# Altium schematic sheet 11-DFlipFlop.SchDoc
size A4; DocumentNumber: 11; SheetNumber: 11; SheetTotal: 26
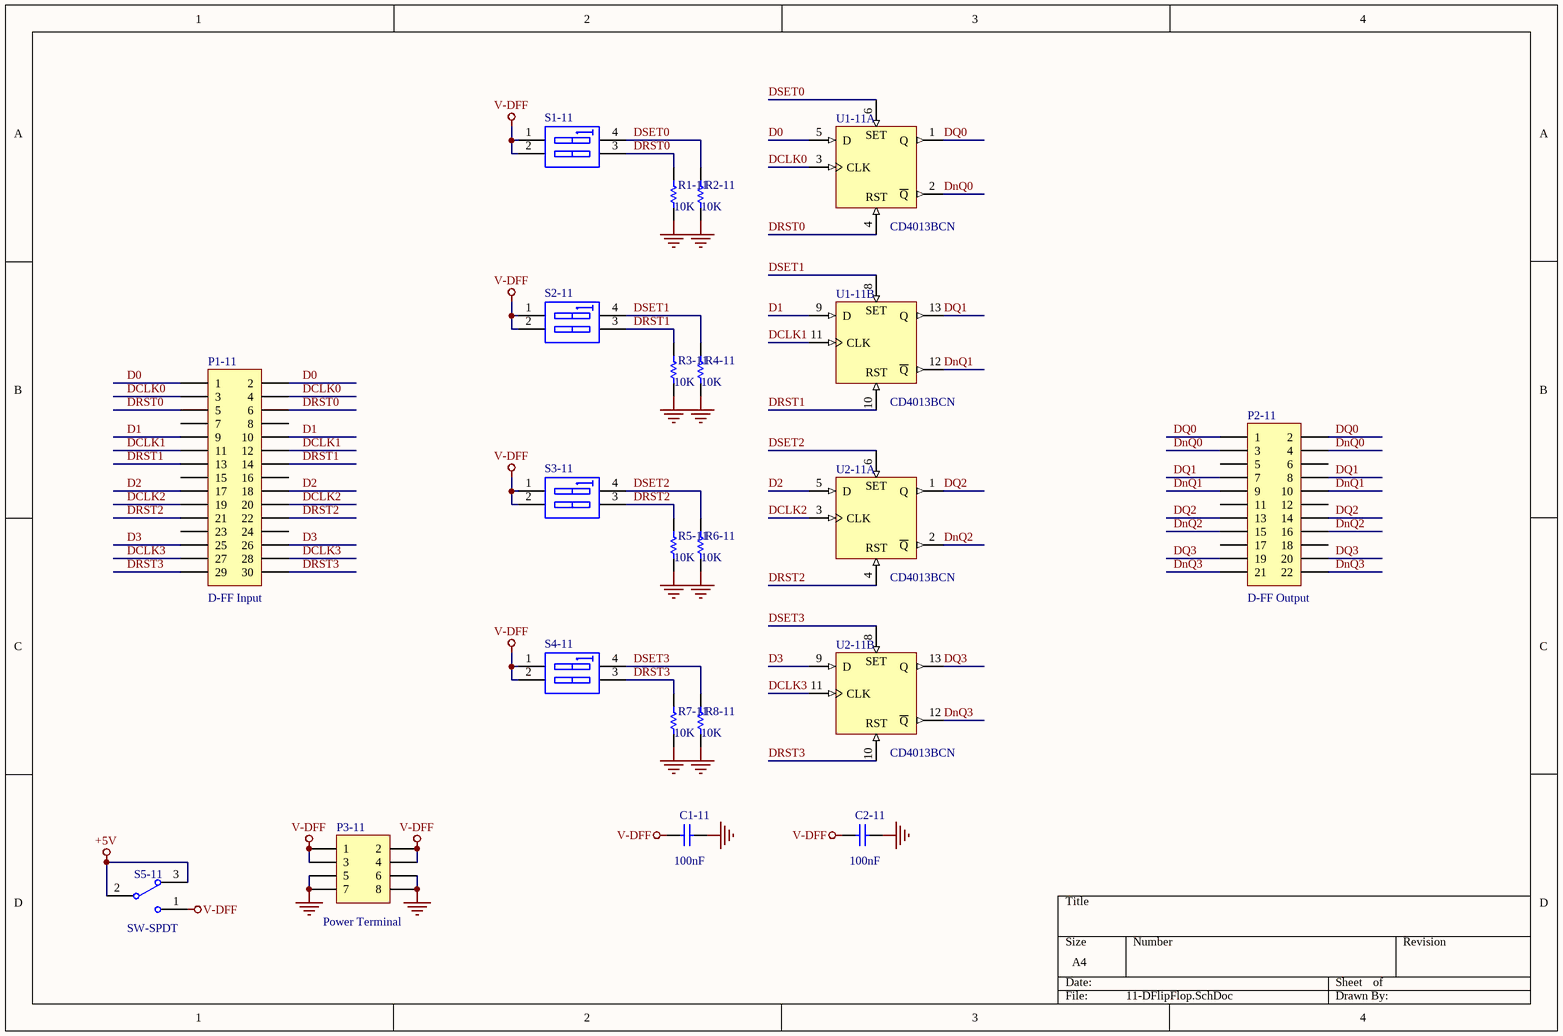
[diagram p0: 11-DFlipFlop.SchDoc]

## Parts
C1-11  value 100nF  [c-0805]  (hidden comment: 104)
C2-11  value 100nF  [c-0805]  (hidden comment: 104)
P1-11  value D-FF Input  [JP2.54-F-2x15A]  (hidden comment: Header 15X2)
P2-11  value D-FF Output  [JP2.54-F-2x11A]  (hidden comment: Header 11X2)
P3-11  Publisher: Power Terminal  [JP2.54-F-2x04A]  (hidden comment: Header 4X2)
R1-11  10K  [R-0805]
R2-11  10K  [R-0805]
R3-11  10K  [R-0805]
R4-11  10K  [R-0805]
R5-11  10K  [R-0805]
R6-11  10K  [R-0805]
R7-11  10K  [R-0805]
R8-11  10K  [R-0805]
S1-11  SW DIP-2  [SW-DIP2-SMD]  (value not drawn)
S2-11  SW DIP-2  [SW-DIP2-SMD]  (value not drawn)
S3-11  SW DIP-2  [SW-DIP2-SMD]  (value not drawn)
S4-11  SW DIP-2  [SW-DIP2-SMD]  (value not drawn)
S5-11  SW-SPDT  [SW-SLIDE-2P-2W]
U1-11  CD4013BCN  [SK-DIP14-300]  (parts A,B of 2)
U2-11  CD4013BCN  [SK-DIP14-300]  (parts A,B of 2)

## Nets
+5V: S5-11.2 S5-11.3
GND: C1-11.2 C2-11.2 P3-11.5 P3-11.6 P3-11.7 P3-11.8 R1-11.1 R2-11.1 R3-11.1 R4-11.1 R5-11.1 R6-11.1 R7-11.1 R8-11.1 U1-11.7(GND) U2-11.7(GND)
V-DFF: C1-11.1 C2-11.1 P3-11.1 P3-11.2 P3-11.3 P3-11.4 S1-11.1(A1) S1-11.2(A2) S2-11.1(A1) S2-11.2(A2) S3-11.1(A1) S3-11.2(A2) S4-11.1(A1) S4-11.2(A2) S5-11.1
VDD: U1-11.14(V-DFF) U2-11.14(V-DFF)
D0: P1-11.1 P1-11.2 U1-11.5(D)
D1: P1-11.9 P1-11.10 U1-11.9(D)
D2: P1-11.17 P1-11.18 U2-11.5(D)
D3: P1-11.25 P1-11.26 U2-11.9(D)
DCLK0: P1-11.3 P1-11.4 U1-11.3(CLK)
DCLK1: P1-11.11 P1-11.12 U1-11.11(CLK)
DCLK2: P1-11.19 P1-11.20 U2-11.3(CLK)
DCLK3: P1-11.27 P1-11.28 U2-11.11(CLK)
DnQ0: P2-11.3 P2-11.4 U1-11.2(~{Q})
DnQ1: P2-11.9 P2-11.10 U1-11.12(~{Q})
DnQ2: P2-11.15 P2-11.16 U2-11.2(~{Q})
DnQ3: P2-11.21 P2-11.22 U2-11.12(~{Q})
DQ0: P2-11.1 P2-11.2 U1-11.1(Q)
DQ1: P2-11.7 P2-11.8 U1-11.13(Q)
DQ2: P2-11.13 P2-11.14 U2-11.1(Q)
DQ3: P2-11.19 P2-11.20 U2-11.13(Q)
DRST0: P1-11.5 P1-11.6 R1-11.2 S1-11.3(B2) U1-11.4(RST)
DRST1: P1-11.13 P1-11.14 R3-11.2 S2-11.3(B2) U1-11.10(RST)
DRST2: P1-11.21 P1-11.22 R5-11.2 S3-11.3(B2) U2-11.4(RST)
DRST3: P1-11.29 P1-11.30 R7-11.2 S4-11.3(B2) U2-11.10(RST)
DSET0: R2-11.2 S1-11.4(B1) U1-11.6(S)
DSET1: R4-11.2 S2-11.4(B1) U1-11.8(S)
DSET2: R6-11.2 S3-11.4(B1) U2-11.6(S)
DSET3: R8-11.2 S4-11.4(B1) U2-11.8(S)

Not connected (* = marked no-connect by the designer): P1-11 7 8 15 16 23 24; P2-11 5 6 11 12 17 18

## Notes on the sheet
- (in symbol CD4013BCN, part A) SET
- (in symbol CD4013BCN, part B) SET

## Library data of the parts
C1-11 C2-11 = Cap: Capacitor; Published: 8-Jun-2000; LatestRevisionDate: 17-Jul-2002; LatestRevisionNote: Re-released for DXP Platform.; PackageReference: RAD-0.3; Publisher: Altium Limited; PackageDescription: Radial Cap, Thru-Hole; 2 Leads; 0.3 in Pin Spacing
P1-11 = Header 15X2: Header, 15-Pin, Dual row; LatestRevisionDate: 17-Jul-2002; LatestRevisionNote: Re-released for DXP Platform.
P2-11 = Header 11X2: Header, 11-Pin, Dual row; LatestRevisionDate: 17-Jul-2002; LatestRevisionNote: Re-released for DXP Platform.
P3-11 = Header 4X2: Header, 4-Pin, Dual row; LatestRevisionDate: 17-Jul-2002; LatestRevisionNote: Re-released for DXP Platform.
R1-11 R2-11 R3-11 R4-11 R5-11 R6-11 R7-11 R8-11 = Res1: Resistor; Published: 8-Jun-2000; LatestRevisionDate: 17-Jul-2002; LatestRevisionNote: Re-released for DXP Platform.; PackageReference: AXIAL-0.3; Publisher: Altium Limited; PackageDescription: Axial Device, Thru-Hole; 2 Leads; 0.3 in Pin Spacing; Value: 10K
S1-11 S2-11 S3-11 S4-11 = SW DIP-2: DIP Switch, 2 Position, SPST; Published: 24-Mar-1999; LatestRevisionDate: 17-Jul-2002; LatestRevisionNote: Re-released for DXP Platform.; PackageReference: DIP-4; Publisher: Altium Limited
S5-11 = SW-SPDT: SPDT Subminiature Toggle Switch, Right Angle Mounting, Vertical Actuation; Published: 24-Mar-1999; LatestRevisionDate: 17-Dec-2003; LatestRevisionNote: Schematic revised, PCB Footprint replaced.; DatasheetVersion: 05-Dec-2000; PackageReference: TL36WW15050; Publisher: Altium Limited; PackageDescription: Switch; 4 Leads; ComponentLink1Description: Manufacturer Link; ComponentLink1URL: http://www.apem.com
U1-11 U2-11 = CD4013BCN: Dual D-Type Flip-Flop; Published: 17-Jul-2002; LatestRevisionDate: 29-May-2009; LatestRevisionNote: Component Body Added.; DatasheetVersion: Jan-1999; PackageVersion: 2000; PackageReference: N14A; Publisher: Altium Limited; PackageDescription: DIP, 14-Pin, Row Spacing 7.62 mm, Pitch 2.54 mm; ComponentLink1Description: Manufacturer Link; ComponentLink1URL: http://www.fairchildsemi.com/